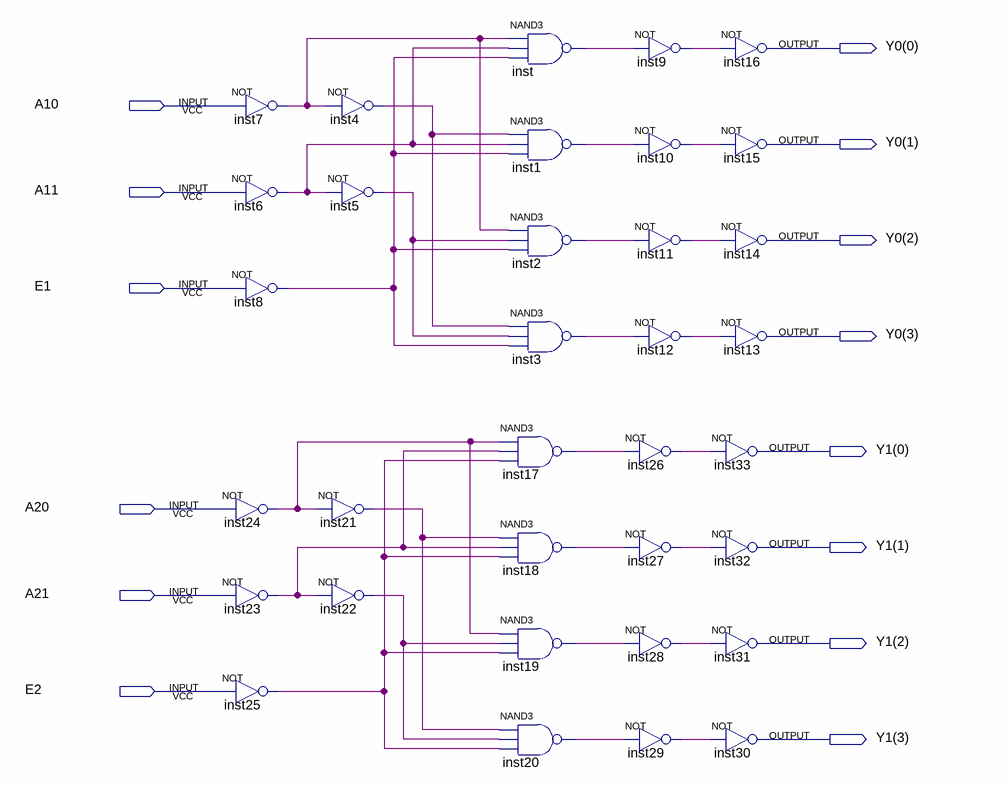
[diagram p0: schematic sheet]
// Quartus schematic C_74HC139.bdf as structural Verilog: 34 symbols, 14 pins
module C_74HC139 (
  input  A10,
  input  A11,
  input  E1,
  input  A20,
  input  A21,
  input  E2,
  output \Y0(0) ,
  output \Y0(1) ,
  output \Y0(2) ,
  output \Y0(3) ,
  output \Y1(0) ,
  output \Y1(1) ,
  output \Y1(2) ,
  output \Y1(3) 
);

  wire inst1_out, inst2_out, inst3_out, inst4_out, inst5_out, inst6_out, inst7_out, inst8_out, inst9_out,
       inst10_out, inst11_out, inst12_out, inst17_out, inst18_out, inst19_out, inst20_out, inst21_out,
       inst22_out, inst23_out, inst24_out, inst25_out, inst26_out, inst27_out, inst28_out, inst29_out,
       inst_out;

  not inst7 (inst7_out, A10);
  not inst6 (inst6_out, A11);
  not inst8 (inst8_out, E1);
  not inst24 (inst24_out, A20);
  not inst23 (inst23_out, A21);
  not inst25 (inst25_out, E2);
  not inst4 (inst4_out, inst7_out);
  not inst5 (inst5_out, inst6_out);
  not inst21 (inst21_out, inst24_out);
  not inst22 (inst22_out, inst23_out);
  nand inst (inst_out, inst7_out, inst6_out, inst8_out);
  nand inst1 (inst1_out, inst4_out, inst6_out, inst8_out);
  nand inst2 (inst2_out, inst7_out, inst5_out, inst8_out);
  nand inst3 (inst3_out, inst4_out, inst5_out, inst8_out);
  nand inst17 (inst17_out, inst24_out, inst23_out, inst25_out);
  nand inst18 (inst18_out, inst21_out, inst23_out, inst25_out);
  nand inst19 (inst19_out, inst24_out, inst22_out, inst25_out);
  nand inst20 (inst20_out, inst21_out, inst22_out, inst25_out);
  not inst9 (inst9_out, inst_out);
  not inst10 (inst10_out, inst1_out);
  not inst11 (inst11_out, inst2_out);
  not inst12 (inst12_out, inst3_out);
  not inst26 (inst26_out, inst17_out);
  not inst27 (inst27_out, inst18_out);
  not inst28 (inst28_out, inst19_out);
  not inst29 (inst29_out, inst20_out);
  not inst16 (\Y0(0) , inst9_out);
  not inst15 (\Y0(1) , inst10_out);
  not inst14 (\Y0(2) , inst11_out);
  not inst13 (\Y0(3) , inst12_out);
  not inst33 (\Y1(0) , inst26_out);
  not inst32 (\Y1(1) , inst27_out);
  not inst31 (\Y1(2) , inst28_out);
  not inst30 (\Y1(3) , inst29_out);
endmodule
